# Altium schematic sheet RADG-USB-S03-V00.SchDoc: RADG USB (USB-C, ESD Protection)
size A3; DrawnBy: Jonn Dillon; DocumentNumber: 5; SheetNumber: 5; SheetTotal: 5; Version: 00; Project: QUTMS RADIO GPS; PageSetup: Record=PageOptions|CenterHorizontal=True|CenterVertical=True|PrintScale=0.97|XCorrection=1.00|YCorrection=1.00|PrintKind=0|BorderSize=5000000|LeftOffset=0|BottomOffset=0|Orientation=2|PaperLength=1000|PaperWidth=1000|Scale=100|PaperSource=7|PrintQuality=-4|MediaType=1|DitherType=10|PaperKind=A4|PrintScaleMode=1
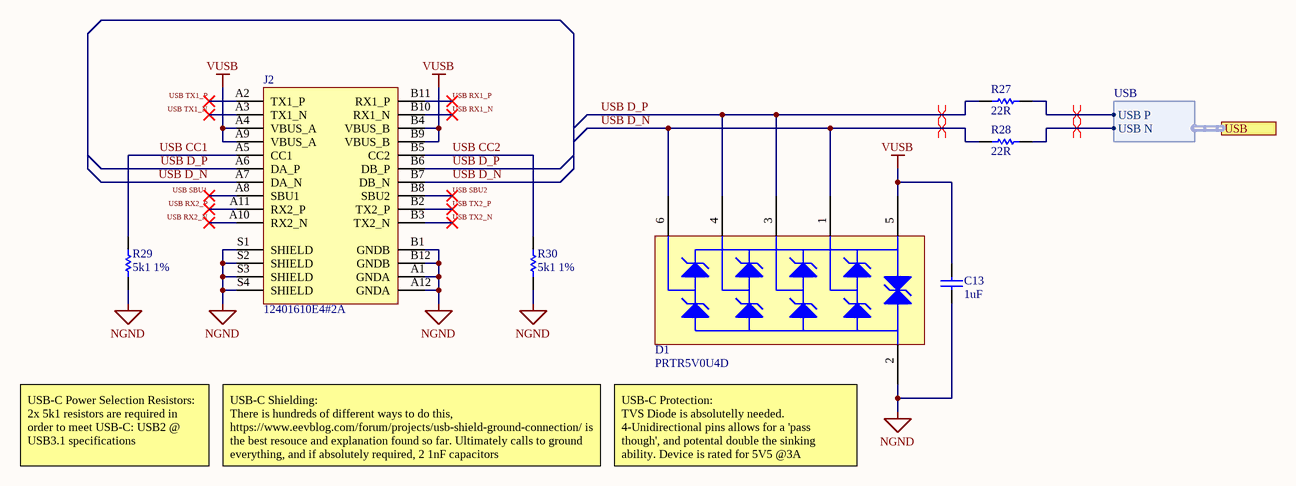
[diagram p0: RADG-USB-S03-V00.SchDoc]

## Parts
C13  1uF  [Cap_Ceramic_0603]
D1  PRTR5V0U4D  [SC-47]
J2  12401610E4#2A  [12401610E4#2A]
R27  22R  [Res_ThinFilm_0603]
R28  22R  [Res_ThinFilm_0603]
R29  5k1 1%  [Res_ThinFilm_0603]
R30  5k1 1%  [Res_ThinFilm_0603]

## Ports
USB (harness USB)

## Harnesses
USB: USB P, USB N

## Nets
NGND: C13.1 D1.2(GND) J2.A1(GNDA) J2.A12(GNDA) J2.B1(GNDB) J2.B12(GNDB) J2.S1(SHIELD) J2.S2(SHIELD) J2.S3(SHIELD) J2.S4(SHIELD) R29.1 R30.1
VUSB: C13.2 D1.5(VCC) J2.A4(VBUS_A) J2.A9(VBUS_A) J2.B4(VBUS_B) J2.B9(VBUS_B)
USB CC1: J2.A5(CC1) R29.2
USB CC2: J2.B5(CC2) R30.2
USB D_N: D1.1(P1) D1.6(P4) J2.A7(DA_N) J2.B7(DB_N) R28.1
USB D_P: D1.3(P2) D1.4(P3) J2.A6(DA_P) J2.B6(DB_P) R27.1
USB RX1_N: J2.B10(RX1_N)
USB RX1_P: J2.B11(RX1_P)
USB RX2_N: J2.A10(RX2_N)
USB RX2_P: J2.A11(RX2_P)
USB SBU1: J2.A8(SBU1)
USB SBU2: J2.B8(SBU2)
USB TX1_N: J2.A3(TX1_N)
USB TX1_P: J2.A2(TX1_P)
USB TX2_N: J2.B3(TX2_N)
USB TX2_P: J2.B2(TX2_P)
NetR27_2: R27.2 ; port USB.USB P
NetR28_2: R28.2 ; port USB.USB N

## Layout directives
differential pair: NetR27_2, NetR28_2, USB D_N, USB D_P

## Notes on the sheet
- USB-C Power Selection Resistors:
  2x 5k1 resistors are required in order to meet USB-C: USB2 @ USB3.1 specifications
- USB-C Shielding:
  There is hundreds of different ways to do this, https://www.eevblog.com/forum/projects/usb-shield-ground-connection/ is the best resouce and explanation found so far. Ultimately calls to ground everything, and if absolutely required, 2 1nF capacitors
- (near D1) USB-C Protection:
  TVS Diode is absolutelly needed. 4-Unidirectional pins allows for a 'pass though', and potental double the sinking ability. Device is rated for 5V5 @3A
- Revision History:
- Sheet Title:
- Rev
- Date
- Description
- Project:
- Size:
- Drawn By:
- A3
- Number:
- Revision:
- Sheet
- Version:
- of
- QUT Motorsport
- O-120, Gardens Point
- 2 George Street
- Brisbane, QLD 4000
- Australia
- Print Date:
- Print Time:
- File Name:

## Library data of the parts
C13 = 1uF 25V 5% X7R 0603: Capacitor, Ceramic, SMD, 1uF, 25V, 5%, X7R, 0603
D1 = PRTR5V0U4D: Clamp Ipp Tvs Diode Surface Mount 6-TSOP
J2 = 12401610E4#2A: USB-C (USB TYPE-C) USB 3.2 Gen 2 (USB 3.1 Gen 2, Superspeed + (USB 3.1)) Receptacle Connector 24 Position Surface Mount, Right Angle; Through Hole
R27 R28 = 22R 5% 0603: Resistor, SMD, 22R, 0.1W, 5%, 0603
R29 R30 = 5k1 1% 0603: Resistor, SMD, 5k1, 0.1W, 1%, 0603